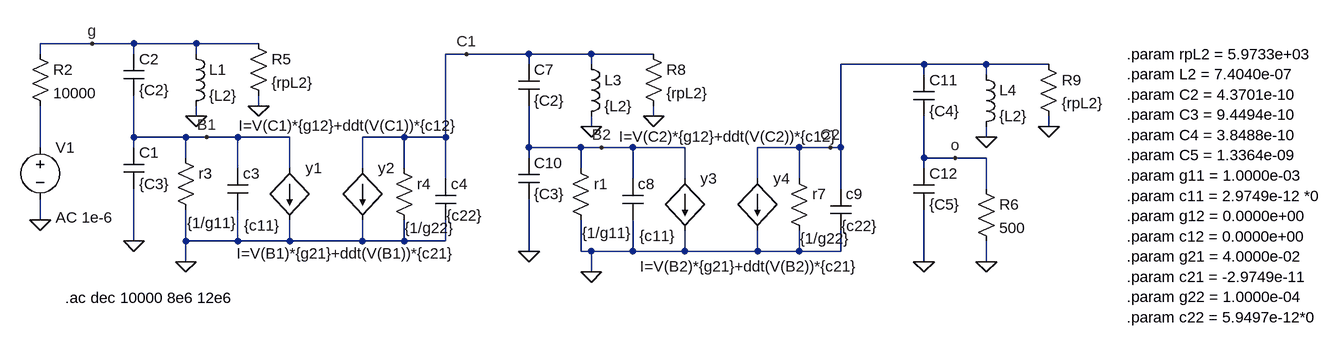
[diagram p0: schematic if.asc]
if.asc, the LTspice schematic file:
Version 4
SHEET 1 880 680
WIRE -1264 80 -1344 80
WIRE -1200 80 -1264 80
WIRE -1104 80 -1200 80
WIRE -1008 80 -1104 80
WIRE -1344 96 -1344 80
WIRE -1200 96 -1200 80
WIRE -1104 96 -1104 80
WIRE -688 96 -720 96
WIRE -592 96 -688 96
WIRE -496 96 -592 96
WIRE -400 96 -496 96
WIRE -592 112 -592 96
WIRE -496 112 -496 96
WIRE 16 112 -112 112
WIRE 112 112 16 112
WIRE 208 112 112 112
WIRE 16 128 16 112
WIRE 112 128 112 112
WIRE -1008 176 -1008 160
WIRE -1104 192 -1104 176
WIRE -400 192 -400 176
WIRE -496 208 -496 192
WIRE 208 208 208 192
WIRE -1200 224 -1200 160
WIRE -1120 224 -1200 224
WIRE -1088 224 -1120 224
WIRE -1040 224 -1088 224
WIRE -960 224 -1040 224
WIRE -784 224 -848 224
WIRE -720 224 -720 96
WIRE -720 224 -784 224
WIRE 112 224 112 208
WIRE -1344 240 -1344 176
WIRE -1200 240 -1200 224
WIRE -592 240 -592 176
WIRE -512 240 -592 240
WIRE -480 240 -512 240
WIRE -432 240 -480 240
WIRE -352 240 -432 240
WIRE -176 240 -240 240
WIRE -128 240 -176 240
WIRE -112 240 -112 112
WIRE -112 240 -128 240
WIRE -1120 256 -1120 224
WIRE -592 256 -592 240
WIRE 16 256 16 192
WIRE 64 256 16 256
WIRE 112 256 64 256
WIRE -1040 272 -1040 224
WIRE -960 272 -960 224
WIRE -848 272 -848 224
WIRE -784 272 -784 224
WIRE -512 272 -512 240
WIRE 16 272 16 256
WIRE -720 288 -720 224
WIRE -432 288 -432 240
WIRE -352 288 -352 240
WIRE -240 288 -240 240
WIRE -176 288 -176 240
WIRE -112 304 -112 240
WIRE 112 304 112 256
WIRE -1344 352 -1344 320
WIRE -1200 384 -1200 304
WIRE -1120 384 -1120 336
WIRE -1040 384 -1040 336
WIRE -1040 384 -1120 384
WIRE -960 384 -960 352
WIRE -960 384 -1040 384
WIRE -848 384 -848 352
WIRE -848 384 -960 384
WIRE -784 384 -784 352
WIRE -784 384 -848 384
WIRE -720 384 -720 352
WIRE -720 384 -784 384
WIRE -592 400 -592 320
WIRE -512 400 -512 352
WIRE -496 400 -512 400
WIRE -432 400 -432 352
WIRE -432 400 -496 400
WIRE -352 400 -352 368
WIRE -352 400 -432 400
WIRE -240 400 -240 368
WIRE -240 400 -352 400
WIRE -176 400 -176 368
WIRE -176 400 -240 400
WIRE -112 400 -112 368
WIRE -112 400 -176 400
WIRE -1120 416 -1120 384
WIRE 16 416 16 336
WIRE 112 416 112 384
WIRE -496 432 -496 400
FLAG -1344 352 0
FLAG -1120 416 0
FLAG -1088 224 B1
FLAG -1008 176 0
FLAG -1104 192 0
FLAG -1200 384 0
FLAG -496 432 0
FLAG -128 240 C2
FLAG -480 240 B2
FLAG -400 192 0
FLAG -496 208 0
FLAG -592 400 0
FLAG 208 208 0
FLAG 112 224 0
FLAG 16 416 0
FLAG 112 416 0
FLAG -688 96 C1
FLAG -1264 80 g
FLAG 64 256 o
SYMBOL cap -1216 96 R0
SYMATTR InstName C2
SYMATTR Value {C2}
SYMBOL res -1360 80 R0
SYMATTR InstName R2
SYMATTR Value 10000
SYMBOL res -1136 240 R0
WINDOW 3 18 116 Left 2
SYMATTR Value {1/g11}
SYMATTR InstName r3
SYMBOL cap -1056 272 R0
WINDOW 3 26 88 Left 2
SYMATTR Value {c11}
SYMATTR InstName c3
SYMBOL res -800 256 R0
WINDOW 3 17 108 Left 2
SYMATTR Value {1/g22}
SYMATTR InstName r4
SYMBOL cap -736 288 R0
WINDOW 3 17 57 Left 2
SYMATTR Value {c22}
SYMATTR InstName c4
SYMATTR SpiceLine Rser=0
SYMBOL bi -960 272 R0
WINDOW 3 -79 -66 Left 2
SYMATTR Value I=V(C1)*{g12}+ddt(V(C1))*{c12}
SYMATTR InstName y1
SYMBOL bi -848 272 R0
WINDOW 3 -194 131 Left 2
SYMATTR Value I=V(B1)*{g21}+ddt(V(B1))*{c21}
SYMATTR InstName y2
SYMBOL res -1024 64 R0
SYMATTR InstName R5
SYMATTR Value {rpL2}
SYMBOL ind -1120 80 R0
SYMATTR InstName L1
SYMATTR Value {L2}
SYMBOL cap -1216 240 R0
SYMATTR InstName C1
SYMATTR Value {C3}
SYMBOL cap -608 112 R0
SYMATTR InstName C7
SYMATTR Value {C2}
SYMBOL res -528 256 R0
WINDOW 3 18 116 Left 2
SYMATTR Value {1/g11}
SYMATTR InstName r1
SYMBOL cap -448 288 R0
WINDOW 3 26 88 Left 2
SYMATTR Value {c11}
SYMATTR InstName c8
SYMBOL res -192 272 R0
WINDOW 3 17 108 Left 2
SYMATTR Value {1/g22}
SYMATTR InstName r7
SYMBOL cap -128 304 R0
WINDOW 3 17 57 Left 2
SYMATTR Value {c22}
SYMATTR InstName c9
SYMATTR SpiceLine Rser=0
SYMBOL bi -352 288 R0
WINDOW 3 -101 -65 Left 2
SYMATTR Value I=V(C2)*{g12}+ddt(V(C2))*{c12}
SYMATTR InstName y3
SYMBOL bi -240 288 R0
WINDOW 3 -181 135 Left 2
SYMATTR Value I=V(B2)*{g21}+ddt(V(B2))*{c21}
SYMATTR InstName y4
SYMBOL res -416 80 R0
SYMATTR InstName R8
SYMATTR Value {rpL2}
SYMBOL ind -512 96 R0
SYMATTR InstName L3
SYMATTR Value {L2}
SYMBOL cap -608 256 R0
SYMATTR InstName C10
SYMATTR Value {C3}
SYMBOL cap 0 128 R0
SYMATTR InstName C11
SYMATTR Value {C4}
SYMBOL res 192 96 R0
SYMATTR InstName R9
SYMATTR Value {rpL2}
SYMBOL ind 96 112 R0
SYMATTR InstName L4
SYMATTR Value {L2}
SYMBOL cap 0 272 R0
SYMATTR InstName C12
SYMATTR Value {C5}
SYMBOL res 96 288 R0
SYMATTR InstName R6
SYMATTR Value 500
SYMBOL voltage -1344 224 R0
WINDOW 123 24 124 Left 2
WINDOW 39 0 0 Left 2
SYMATTR InstName V1
SYMATTR Value ""
SYMATTR Value2 AC 1e-6
TEXT -1306 472 Left 2 !.ac dec 10000 8e6 12e6
TEXT 328 96 Left 2 !.param rpL2 = 5.9733e+03 \n.param L2 = 7.4040e-07 \n.param C2 = 4.3701e-10 \n.param C3 = 9.4494e-10 \n.param C4 = 3.8488e-10 \n.param C5 = 1.3364e-09 \n.param g11 = 1.0000e-03 \n.param c11 = 2.9749e-12 *0\n.param g12 = 0.0000e+00 \n.param c12 = 0.0000e+00 \n.param g21 = 4.0000e-02 \n.param c21 = -2.9749e-11 \n.param g22 = 1.0000e-04 \n.param c22 = 5.9497e-12*0

The netlist it stands for:
* if.asc
C2 g B1 {C2}
R2 g N001 10000
r3 B1 0 {1/g11}
c3 B1 0 {c11}
r4 C1 0 {1/g22}
c4 C1 0 {c22} Rser=0
B§y1 B1 0 I=V(C1)*{g12}+ddt(V(C1))*{c12}
B§y2 C1 0 I=V(B1)*{g21}+ddt(V(B1))*{c21}
R5 g 0 {rpL2}
L1 g 0 {L2}
C1 B1 0 {C3}
C7 C1 B2 {C2}
r1 B2 0 {1/g11}
c8 B2 0 {c11}
r7 C2 0 {1/g22}
c9 C2 0 {c22} Rser=0
B§y3 B2 0 I=V(C2)*{g12}+ddt(V(C2))*{c12}
B§y4 C2 0 I=V(B2)*{g21}+ddt(V(B2))*{c21}
R8 C1 0 {rpL2}
L3 C1 0 {L2}
C10 B2 0 {C3}
C11 C2 o {C4}
R9 C2 0 {rpL2}
L4 C2 0 {L2}
C12 o 0 {C5}
R6 o 0 500
V1 N001 0 AC 1e-6
.ac dec 10000 8e6 12e6
.param rpL2 = 5.9733e+03
.param L2 = 7.4040e-07
.param C2 = 4.3701e-10
.param C3 = 9.4494e-10
.param C4 = 3.8488e-10
.param C5 = 1.3364e-09
.param g11 = 1.0000e-03
.param c11 = 2.9749e-12 *0
.param g12 = 0.0000e+00
.param c12 = 0.0000e+00
.param g21 = 4.0000e-02
.param c21 = -2.9749e-11
.param g22 = 1.0000e-04
.param c22 = 5.9497e-12*0
.backanno
.end